# Altium schematic sheet USB.SchDoc
size A4
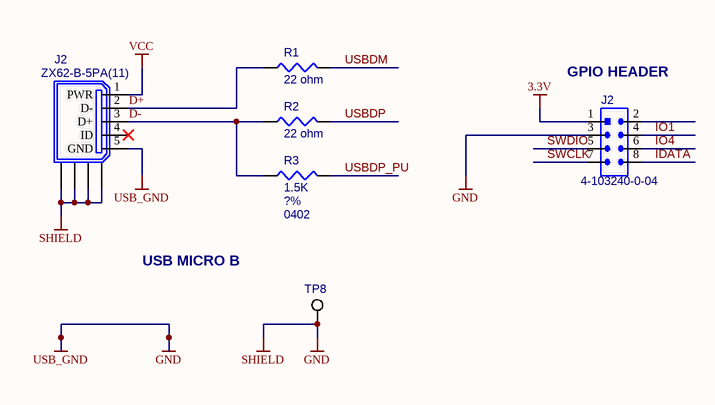
[diagram p0: USB.SchDoc]

## Parts
(Parts that share a designator on the sheet are numbered #1, #2 ... from top to bottom, then left to right.)
J2#1  ZX62-B-5PA(11)  [ZX62-B-5PA(11)]
J2#2  4-103240-0-04  [4-103240-0-04]
R1  22 ohm  [RESISTOR_0402]
R2  22 ohm  [RESISTOR_0402]
R3  1.5K  Package: 0402  Tolerance: ?%  [RESISTOR_0402]
TP8  TEST POINT  [TEST_POINT_PAD]  (value not drawn)  (no BOM)

## Nets
3.3V: J2#2.1
GND: J2#1.5(GND) J2#1.6(SHIELD) J2#1.7(SHIELD) J2#1.8(SHIELD) J2#1.9(SHIELD) J2#2.3 TP8.1  [also labelled SHIELD, USB_GND]
VCC: J2#1.1(PWR)
D+: J2#1.2(D-) R1.1
D-: J2#1.3(D+) R2.1 R3.1
IDATA: J2#2.8
IO1: J2#2.4
IO4: J2#2.6
SWCLK: J2#2.7
SWDIO: J2#2.5
USBDM: R1.2
USBDP: R2.2
USBDP_PU: R3.2

Not connected (* = marked no-connect by the designer): J2#1 4(ID)*; J2#2 2

## Notes on the sheet
- (near J2#2) GPIO HEADER
- USB MICRO B

## Library data of the parts
J2#1 = ZX62-B-5PA(11): CONNECTOR, USB MICRO B, R/A, SMD; Manufacturer: HIROSE; Part Number: ZX62-B-5PA(11)
J2#2 = 4-103240-0-04: CONNECTOR, HEADER, 2X4, 0.1" PITCH; Manufacturer: TE CONNECTIVITY; Part Number: 4-103240-0-04; Pitch: 0.1"
R1 R2 = RESISTOR: RES, 22 OHM, 1/10W, ?%, 0402; Manufacturer: PANASONIC; Part Number: ERJ-2RKF22R0X; Power Rating: 1/10W; Package: 0402; Tolerance: ?%
R3 = RESISTOR: RES, 1.5K OHM, 1/10W, ?%, 0402; Manufacturer: PANASONIC; Part Number: ERJ-2RKF1501X; Power Rating: 1/10W
TP8 = TEST_POINT: Manufacturer: *; Part Number: *